# EAGLE design thruster_plate (EAGLE 7.2.0)
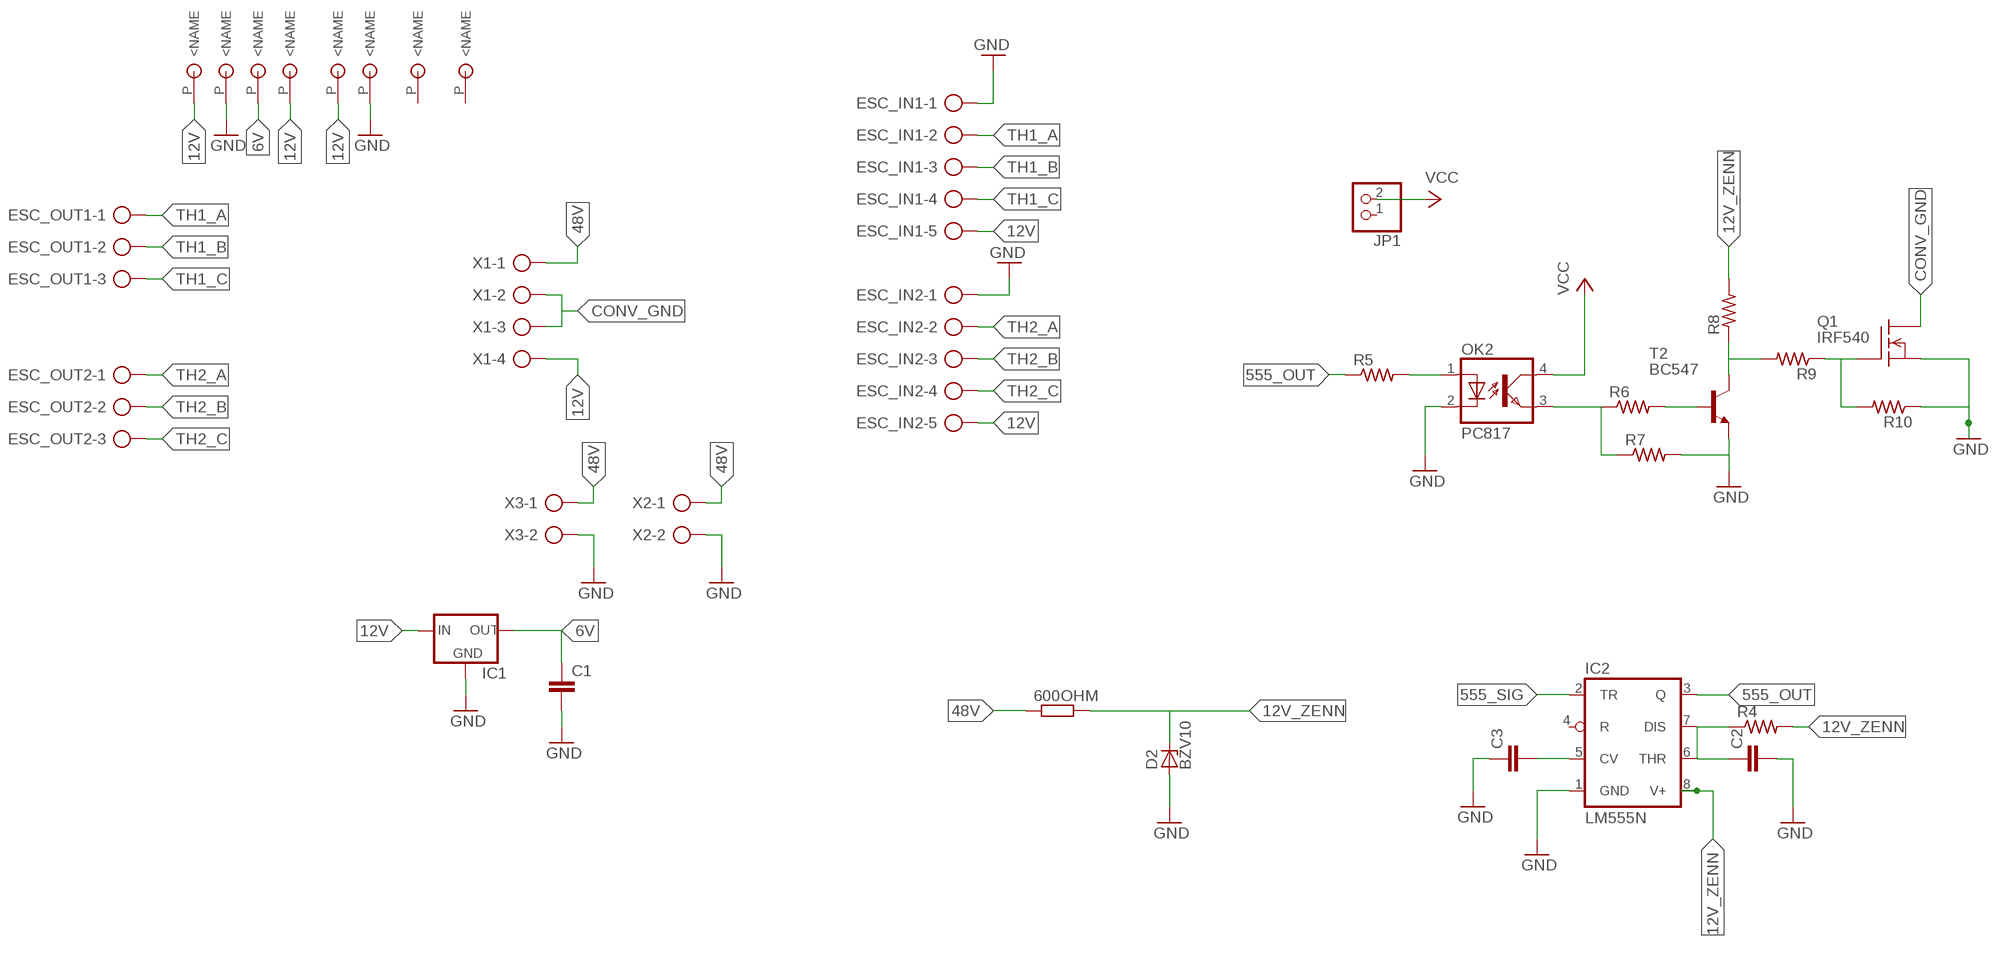
[diagram p0: schematic, sheet 1]

## Parts
12  CU-SPACER  [CU-SPACER]
12-1  CU-SPACER  [CU-SPACER]
12-2  CU-SPACER  [CU-SPACER]
12-3  CU-SPACER  [CU-SPACER]
12-4  CU-SPACER  [CU-SPACER]
12-6  CU-SPACER  [CU-SPACER]
600OHM  R-EU_V235/17  [V235/17]
C1  C-EU050-024X044  [C050-024X044]
C2  C-EU050-035X075  [C050-035X075]
C3  C-EU050-024X044  [C050-024X044]
D2  BZV10  [DO34Z7]
ESC_IN1  AK500/5  [AK500/5]
ESC_IN2  AK500/5  [AK500/5]
ESC_OUT1  AK500/3  [AK500/3]
ESC_OUT2  AK500/3  [AK500/3]
IC1  78XXL  [78XXL]
IC2  LM555N  [DIL08]
JP1  PINHD-1X2  [1X02]
OK2  PC817  [DIL04]
Q1  IRF540  [TO220]
R4  R-US_0204/7  [0204/7]
R5  R-US_0204/7  [0204/7]
R6  R-US_0204/7  [0204/7]
R7  R-US_0204/7  [0204/7]
R8  R-US_0204/7  [0204/7]
R9  R-US_0204/7  [0204/7]
R10  R-US_0204/7  [0204/7]
T2  BC547  [TO92]
U$2  CU-SPACER  [CU-SPACER]
U$3  CU-SPACER  [CU-SPACER]
X1  AK500/4  [AK500/4]
X2  AK500/2  [AK500/2]
X3  AK500/2  [AK500/2]

## Nets
6V: C1.1 IC1.OUT U$3.P(<NAME)
12V: 12-1.P(<NAME) 12-2.P(<NAME) 12.P(<NAME) ESC_IN1.5 ESC_IN2.5 IC1.IN X1.4
12V_ZENN: 600OHM.2 D2.C IC2.8(V+) R4.2 R8.2
48V: 600OHM.1 X1.1 X2.1 X3.1
555_OUT: IC2.3(Q) R5.1
555_SIG: IC2.2(TR)
CONV_GND: Q1.2(D) X1.2 X1.3
GND: 12-3.P(<NAME) C1.2 C2.2 C3.1 D2.A ESC_IN1.1 ESC_IN2.1 IC1.GND IC2.1(GND) OK2.2(C) Q1.3(S) R7.2 R10.1 T2.1(E) U$2.P(<NAME) X2.2 X3.2
N$8: OK2.1(A) R5.2
N$9: OK2.3(EMIT) R6.1 R7.1
N$10: R6.2 T2.2(B)
N$13: R8.1 R9.2 T2.3(C)
N$14: C3.2 IC2.5(CV)
N$15: Q1.1(G) R9.1 R10.2
N$16: C2.1 IC2.6(THR) IC2.7(DIS) R4.1
TH1_A: ESC_IN1.2 ESC_OUT1.1
TH1_B: ESC_IN1.3 ESC_OUT1.2
TH1_C: ESC_IN1.4 ESC_OUT1.3
TH2_A: ESC_IN2.2 ESC_OUT2.1
TH2_B: ESC_IN2.3 ESC_OUT2.2
TH2_C: ESC_IN2.4 ESC_OUT2.3
VCC: JP1.2 OK2.4(COL)
Unconnected: 12-4.P(<NAME) 12-6.P(<NAME) IC2.4(R) JP1.1

## Library data of the parts
12 12-1-12-4 12-6 U$2 U$3 = Aquaphoton:CU-SPACER
600OHM = rcl:R-EU_: RESISTOR, European symbol
C1-C3 = rcl:C-EU: CAPACITOR, European symbol
D2 = diode:BZV10: Z DIODE
ESC_IN1 ESC_IN2 = con-ptr500:AK500/5: CONNECTOR; OC_FARNELL: unknown; OC_NEWARK: unknown
ESC_OUT1 ESC_OUT2 = con-ptr500:AK500/3: CONNECTOR; OC_FARNELL: unknown; OC_NEWARK: unknown
IC1 = v-reg:78XXL: VOLTAGE REGULATOR
IC2 = linear:*555: TIMER
JP1 = pinhead:PINHD-1X2: PIN HEADER
OK2 = optocoupler:PC817: SHARP OPTO COUPLER; MPN: PC817X4J000F; OC_FARNELL: 9707727; OC_NEWARK: 97K7059
Q1 = transistor-fet:IRF540: N-Channel Enhancement MOSFET (HEXFET); 100V; 28A; 0,077Ohm
R4-R10 = rcl:R-US_: RESISTOR, American symbol
T2 = transistor:BC547: NPN TRANSISTOR
X1 = con-ptr500:AK500/4: CONNECTOR; OC_FARNELL: unknown; OC_NEWARK: unknown
X2 X3 = con-ptr500:AK500/2: CONNECTOR; OC_FARNELL: unknown; OC_NEWARK: unknown

## Net classes
0 default: width 1 mm

## Board
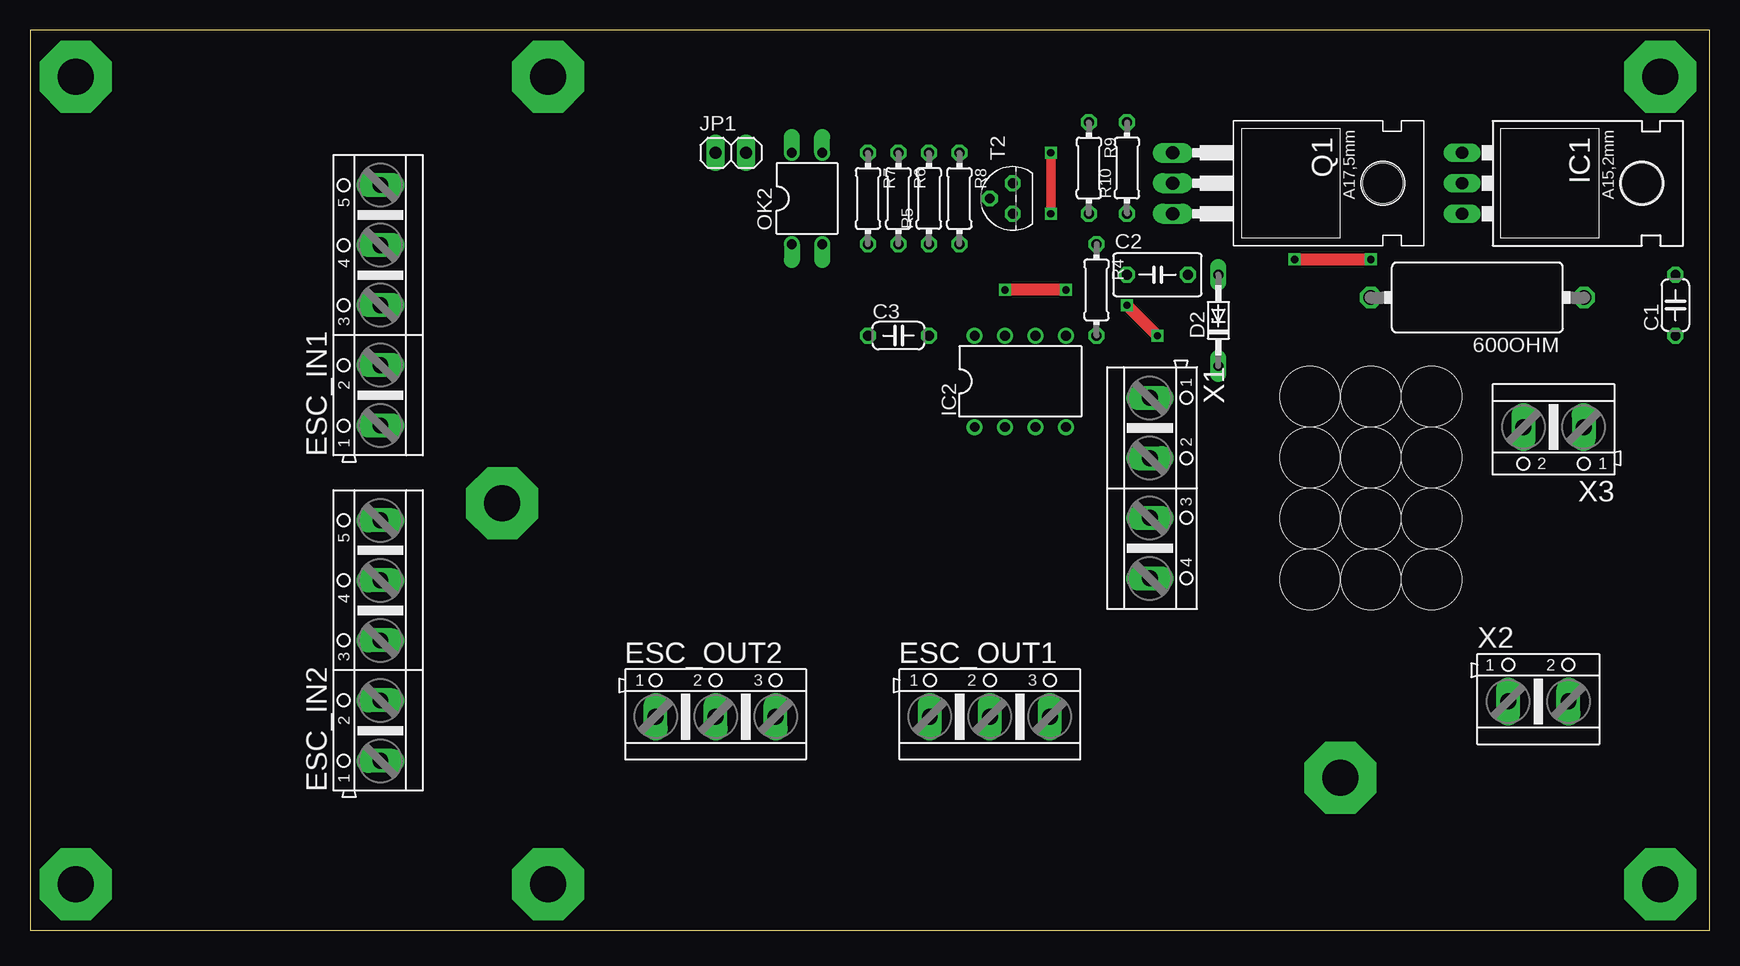
[diagram p1: board, top side]
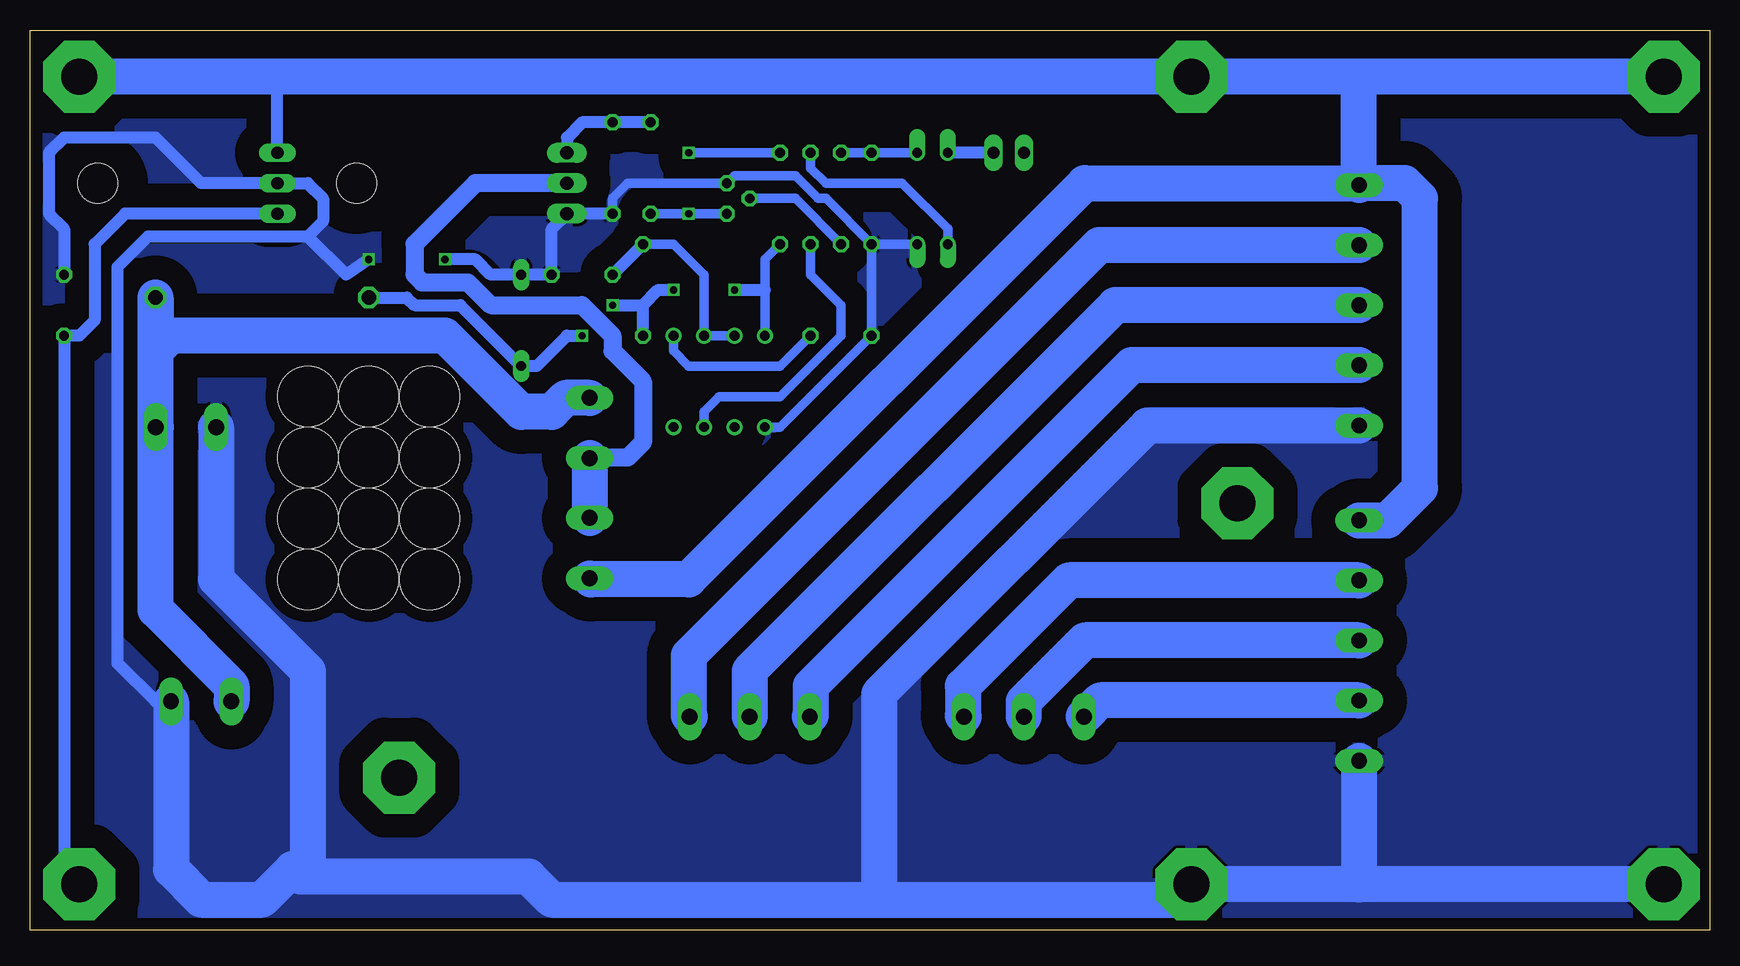
[diagram p2: board, bottom side, seen from below]

Size 140 x 75 mm. Coordinates in mm from the lower left corner, seen from the top.
Outline: 0,75 0,0 140,0 140,75 0,75
Copper layers (1*16): Top 0.035mm / dielectric 1.5mm / Bottom 0.035mm
Design rules "default *": minimum track width 10mil, minimum drill 24mil, track to track 2mm, track to pad 2mm, pad to pad 8mil, via to via 8mil, smd to smd 8mil, copper to edge 40mil, drill to drill 8mil, minimum pad ring 10mil, minimum via ring 8mil, stop-mask expansion 4mil, vias tented up to drill 0mil, thermal gap 10mil
Holes 5 mm at 111.76,44.45 111.76,39.37 111.76,34.29 111.76,29.21 116.84,44.45 116.84,39.37 116.84,34.29 116.84,29.21 106.68,44.45 106.68,39.37 106.68,34.29 106.68,29.21

### Footprints (pad centres in the part's own frame; a part is rotated, then mirrored left to right if it is on the bottom)
CU-SPACER = drill 3 pad 6 octagon: P 0,0
V235/17 = drill 1.194 octagon: 1 -8.89,0; 2 8.89,0
C050-024X044 = drill 0.813 octagon: 1 -2.54,0; 2 2.54,0
C050-035X075 = drill 0.813 octagon: 1 -2.54,0; 2 2.54,0
DO34Z7 = drill 0.813 long: A 3.81,0; C -3.81,0
AK500/5 = drill 1.321 long: 1 -10.033,0; 2 -5.004,0; 3 0,0; 4 5.004,0; 5 10.008,0
AK500/3 = drill 1.321 long: 1 -5.004,0; 2 0,0; 3 5.004,0
78XXL = drill 1.016 long: GND 0,-3.81; IN -2.54,-3.81; OUT 2.54,-3.81 | hole 3.302: 0,11.176
DIL08 = drill 0.813 pad 1.27: 1 -3.81,-3.81; 2 -1.27,-3.81; 3 1.27,-3.81; 4 3.81,-3.81; 5 3.81,3.81; 6 1.27,3.81; 7 -1.27,3.81; 8 -3.81,3.81
1X02 = drill 1.016 long: 1 -1.27,0; 2 1.27,0
DIL04 = drill 0.813 offset: 1 -1.27,-3.81; 2 1.27,-3.81; 3 1.27,3.81; 4 -1.27,3.81
TO220 = drill 1.118 long: 1 -2.54,-6.35; 2 0,-6.35; 3 2.54,-6.35 | hole 3.302: 0,11.176
0204/7 = drill 0.813 octagon: 1 -3.81,0; 2 3.81,0
TO92 = drill 0.813 octagon: 1 1.27,0; 2 0,1.905; 3 -1.27,0
AK500/4 = drill 1.321 long: 1 -7.518,0; 2 -2.489,0; 3 2.489,0; 4 7.518,0
AK500/2 = drill 1.321 long: 1 -2.515,0; 2 2.515,0

### Placement (x,y rotation side)
12  43.18,71.12 0 top
12-1  3.81,71.12 0 top
12-2  135.89,71.12 0 top
12-3  3.81,3.81 0 top
12-4  39.37,35.56 0 top
12-6  109.22,12.7 0 top
600OHM  120.65,52.7 180 top
C1  137.16,52.07 90 top
C2  93.98,54.61 0 top
C3  72.39,49.53 0 top
D2  99.06,50.8 90 top
ESC_IN1  29.21,52.07 90 top
ESC_IN2  29.21,24.13 90 top
ESC_OUT1  80.01,17.78 0 top
ESC_OUT2  57.15,17.78 0 top
IC1  123.19,62.23 270 top
IC2  82.55,45.72 0 top
JP1  58.42,64.77 0 top
OK2  64.77,60.96 0 top
Q1  101.6,62.23 270 top
R4  88.9,53.34 270 top
R5  74.93,60.96 90 top
R6  72.39,60.96 270 top
R7  69.85,60.96 270 top
R8  77.47,60.96 270 top
R9  88.27,63.5 270 top
R10  91.44,63.5 90 top
T2  81.92,60.96 90 top
U$2  43.18,3.81 180 top
U$3  135.89,3.81 0 top
X1  93.34,36.83 270 top
X2  125.73,19.05 0 top
X3  127,41.91 180 top

### Tracks (layer width: path | path; a pad name or v marks a point on that pad's centre or on a via)
6V
  Bottom 1: U$3.P 137.16,5.08 C1.1 135.89,49.53 134.62,50.8 134.62,57.15 132.08,59.69 IC1.OUT
12V
  Bottom 1: IC1.IN 119.38,71.12
  Bottom 3: 12-1.P 29.21,71.12 | 29.21,71.12 12.P 119.38,71.12 12-2.P | 29.21,62.23 29.21,71.12 | ESC_IN2.5 26.82,34.14 24.13,36.83 24.13,60.96 25.4,62.23 29.21,62.23 | 29.21,62.23 ESC_IN1.5 29.36,62.23 52.07,62.23 85.09,29.21 93.24,29.21 X1.4
12V_ZENN  (via drill 0.6)
  Top 1: v86.36,53.34 v81.28,53.34 | v93.98,49.53 v91.44,52.07
  Bottom 0.8: IC2.8 78.74,53.34 78.74,55.88 R8.2
  Bottom 1: R4.2 88.9,52.07 | 88.9,52.07 87.63,53.34 v86.36,53.34 | v81.28,53.34 78.74,53.34 | v93.98,49.53 95.25,49.53 97.79,46.99 D2.C 104.14,52.07 107.95,52.07 108.58,52.7 600OHM.2 | v91.44,52.07 88.9,52.07
48V
  Bottom 3: X2.1 123.19,19.07 123.19,20.32 129.54,26.67 129.54,41.88 X3.1 129.51,49.53 | 129.51,49.53 129.51,51.41 600OHM.1 129.54,50.8 | X1.1 95.35,44.35 96.52,43.18 99.06,43.18 105.41,49.53 128.27,49.53 129.54,48.26 129.54,49.51 129.51,49.53
555_OUT
  Bottom 0.8: R5.1 74.93,54.61 72.39,52.07 72.39,49.53 77.47,44.45 82.55,44.45 83.82,43.18 IC2.3
CONV_GND
  Bottom 1: 91.44,39.37 93.29,39.37
  Bottom 1.5: Q1.2 102.87,62.23 107.95,57.15 107.95,54.61 107.31,53.98 103.5,53.98 101.6,52.07 93.98,52.07 91.44,49.53 91.44,48.26 88.9,45.72 88.9,40.64 90.17,39.37 93.29,39.37 X1.2
  Bottom 3: X1.2 X1.3
GND  (via drill 0.6)
  Top 1: v105.41,55.88 v111.76,55.88
  Bottom 0.8: OK2.2 R7.2 | R7.2 C3.1 77.47,41.91 IC2.1 | R7.2 73.66,60.96 74.3,60.96 76.2,62.87 81.28,62.87 T2.1 90.17,62.23 91.44,60.96 R10.1
  Bottom 1: 128.27,7.64 X2.2 129.54,19.05 132.72,22.23 132.72,55.24 130.18,57.78 116.84,57.78 | C1.2 137.16,58.42 138.43,59.69 138.43,64.77 137.16,66.04 129.54,66.04 125.73,62.23 IC1.GND 116.84,62.23 115.57,60.96 115.57,59.05 116.84,57.78 | R10.1 Q1.3 96.52,58.42 C2.2 D2.A 101.6,54.61 102.87,55.88 v105.41,55.88 | 116.84,57.78 113.67,54.61 v111.76,55.88
  Bottom 3: 12-3.P 29.21,3.81 | 29.21,3.81 U$2.P 44.45,2.54 68.58,2.54 | X2.2 128.25,5.05 125.73,2.54 120.65,2.54 118.11,5.08 117.47,4.45 | 68.58,2.54 96.52,2.54 98.42,4.45 117.47,4.45 | X3.2 124.48,29.23 116.84,21.59 116.84,5.08 117.47,4.45 | 68.58,2.54 69.22,3.17 69.22,19.68 46.86,42.04 ESC_IN1.1 | 29.21,3.81 ESC_IN2.1 29.08,13.97
  pour Bottom: 0,74.93 139.7,74.93 139.7,0 0,0
N$8
  Bottom 0.8: OK2.1 63.5,58.42 67.31,62.23 73.66,62.23 74.93,63.5 R5.2
N$9
  Bottom 0.8: OK2.3 R7.1 R6.1
N$10
  Bottom 0.8: R6.2 76.2,60.96 T2.2
N$13  (via drill 0.6)
  Top 0.8: v85.09,64.77 v85.09,59.69
  Bottom 0.8: R8.1 v85.09,64.77 | R9.2 v85.09,59.69 T2.3
N$14
  Bottom 0.8: C3.2 77.47,46.99 85.09,46.99 86.36,48.26 IC2.5
N$15
  Bottom 1: R9.1 R10.2 93.98,67.31 95.25,66.04 Q1.1
N$16
  Bottom 0.8: IC2.7 IC2.6 83.82,54.61 86.36,57.15 R4.1
  Bottom 1: C2.1 R4.1
TH1_A
  Bottom 3: ESC_IN1.2 48.18,47.07 74.93,20.32 74.93,17.86 ESC_OUT1.1
TH1_B
  Bottom 3: ESC_IN1.3 49.53,52.07 80.01,21.59 ESC_OUT1.2
TH1_C
  Bottom 3: ESC_IN1.4 50.88,57.07 85.09,22.86 85.09,17.86 ESC_OUT1.3
TH2_A
  Bottom 3: ESC_IN2.2 50.8,19.13 ESC_OUT2.1
TH2_B
  Bottom 3: ESC_IN2.3 52.07,24.13 57.15,19.05 ESC_OUT2.2
TH2_C
  Bottom 3: ESC_IN2.4 53.42,29.13 62.23,20.32 62.23,17.86 ESC_OUT2.3
VCC
  Bottom 1: JP1.2 OK2.4